# Altium schematic sheet MB1-LED_BUTTON.SchDoc: Leds & Buttons
size A; Author: Nguyen Van Hien; DrawnBy: MBoard team; DocumentNumber: 7; Revision: 1.1; SheetNumber: 7; SheetTotal: 7; DocumentName: LED_BUTTON
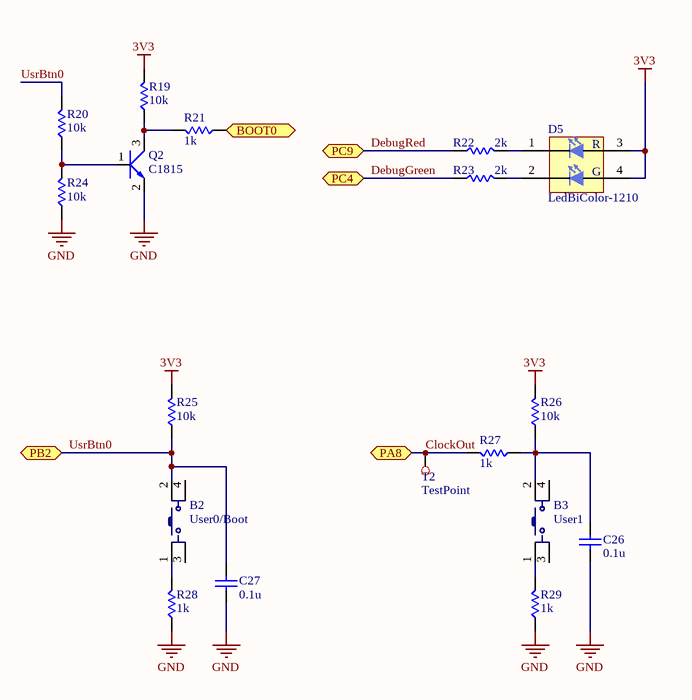
[diagram p0: MB1-LED_BUTTON.SchDoc]

## Parts
B2  User0/Boot  [Horizon_SW_4pin_rectangular]
B3  User1  [Horizon_SW_4pin_rectangular]
C26  value 0.1u  [SM_0805_C_CERAMIC]  (hidden comment: CAP_Ceramic)
C27  value 0.1u  [SM_0805_C_CERAMIC]  (hidden comment: CAP_Ceramic)
D5  LedBiColor-1210  [Led-BiColor]
Q2  C1815  [SOT23]
R19  value 10k  [SM_0805_R]
R20  value 10k  [SM_0805_R]
R21  value 1k  [SM_0805_R]
R22  value 2k  [SM_0805_R]
R23  value 2k  [SM_0805_R]
R24  value 10k  [SM_0805_R]
R25  value 10k  [SM_0805_R]
R26  value 10k  [SM_0805_R]
R27  value 1k  [SM_0805_R]
R28  value 1k  [SM_0805_R]
R29  value 1k  [SM_0805_R]
T2  TestPoint  [TestPoint]

## Ports
BOOT0 (bidir), PA8 (bidir), PB2 (bidir), PC4 (bidir), PC9 (bidir)

## Nets
3V3: D5.3(R+) D5.4(G+) R19.2 R25.2 R26.2
GND: C26.1 C27.1 Q2.2(E) R24.1 R28.1 R29.1
BOOT0: R21.1 ; port BOOT0
ClockOut: R27.2 T2.1 ; port PA8
DebugGreen: R23.1 ; port PC4
DebugRed: R22.1 ; port PC9
UsrBtn0: B2.2 C27.2 R20.2 R25.1 ; port PB2
NetB2_1: B2.1 R28.2
NetB3_1: B3.1 R29.2
NetB3_2: B3.2 C26.2 R26.1 R27.1
NetD5_1: D5.1(R-) R22.2
NetD5_2: D5.2(G-) R23.2
NetQ2_1: Q2.1(B) R20.1 R24.2
NetQ2_3: Q2.3(C) R19.1 R21.2

Not connected (* = marked no-connect by the designer): B2 3 4; B3 3 4

## Notes on the sheet
- (in symbol LedBiColor-1210) R; G

## Library data of the parts
B2 B3 = Button: Tact switch
C26 C27 = C_Ceramic: Non-polarity ceramic capacitor; Published: 8-Jun-2000; LatestRevisionDate: 17-Jul-2002; LatestRevisionNote: Re-released for DXP Platform.; PackageReference: RAD-0.3; Publisher: Altium Limited; PackageDescription: Radial Cap, Thru-Hole; 2 Leads; 0.3 in Pin Spacing
R19-R29 = R: Resistor; Published: 8-Jun-2000; LatestRevisionDate: 29-May-2009; LatestRevisionNote: IPC-7351 Footprint Added.; PackageReference: J1-0603; Publisher: Altium Limited; PackageDescription: Chip Resistor